# EAGLE design microSDport (EAGLE 8.4.0)
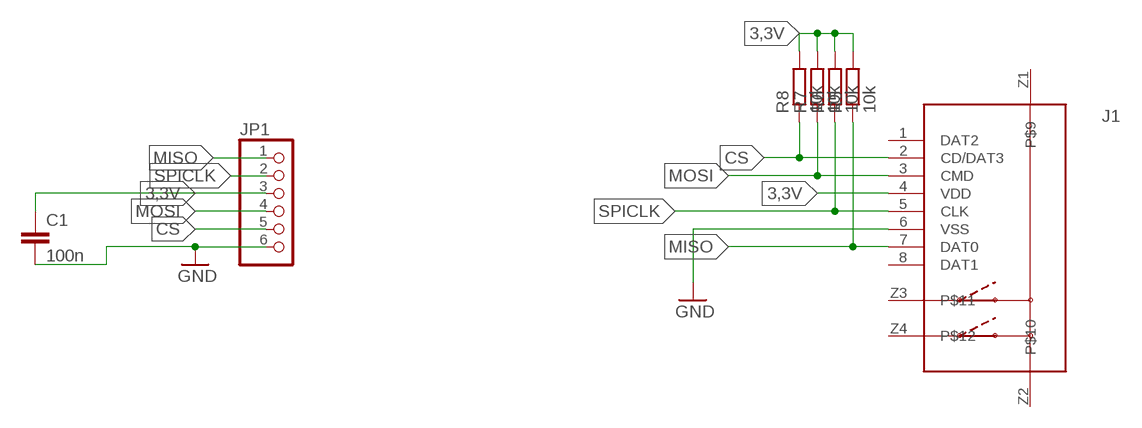
[diagram p0: schematic, sheet 1]

## Parts
C1  100n  C-EUC0805K  [C0805K]
J1  693072010801  [693072010801]
JP1  PINHD-1X6  [1X06]
R5  10k  R-EU_R0805  [R0805]
R6  10k  R-EU_R0805  [R0805]
R7  10k  R-EU_R0805  [R0805]
R8  10k  R-EU_R0805  [R0805]

## Nets
3,3V: C1.1 J1.4(VDD) JP1.3 R5.2 R6.2 R7.2 R8.2
CS: J1.2(CD/DAT3) JP1.5 R8.1
GND: C1.2 J1.6(VSS) JP1.6
MISO: J1.7(DAT0) JP1.1 R5.1
MOSI: J1.3(CMD) JP1.4 R7.1
SPICLK: J1.5(CLK) JP1.2 R6.1
Unconnected: J1.1(DAT2) J1.8(DAT1) J1.Z1 J1.Z2 J1.Z3 J1.Z4

## Library data of the parts
C1 = resistor:C-EU: CAPACITOR, European symbol
J1 = Wurth_Elektronik_Electromechanic_Input-Output_Connectors_rev16b:693072010801: WR-CRD MICRO SD CARD CONNECTOR HINGE 8PINS=>Code : Con_I-O_COM_CRD_SD_Micro_696072010801 <http://katalog.we-online.de/media/images/eican/Con_I-O_COM_CRD_SD_Micro_696072010801_pf2.jpg> Details see: http://katalog.we-online.de/en/em/693_072_010_801 Created 2014-07-09, Karrer Zheng 2014 (C) Würth Elektronik
JP1 = pinhead:PINHD-1X6: PIN HEADER
R5-R8 = resistor:R-EU_: RESISTOR, European symbol

## Board
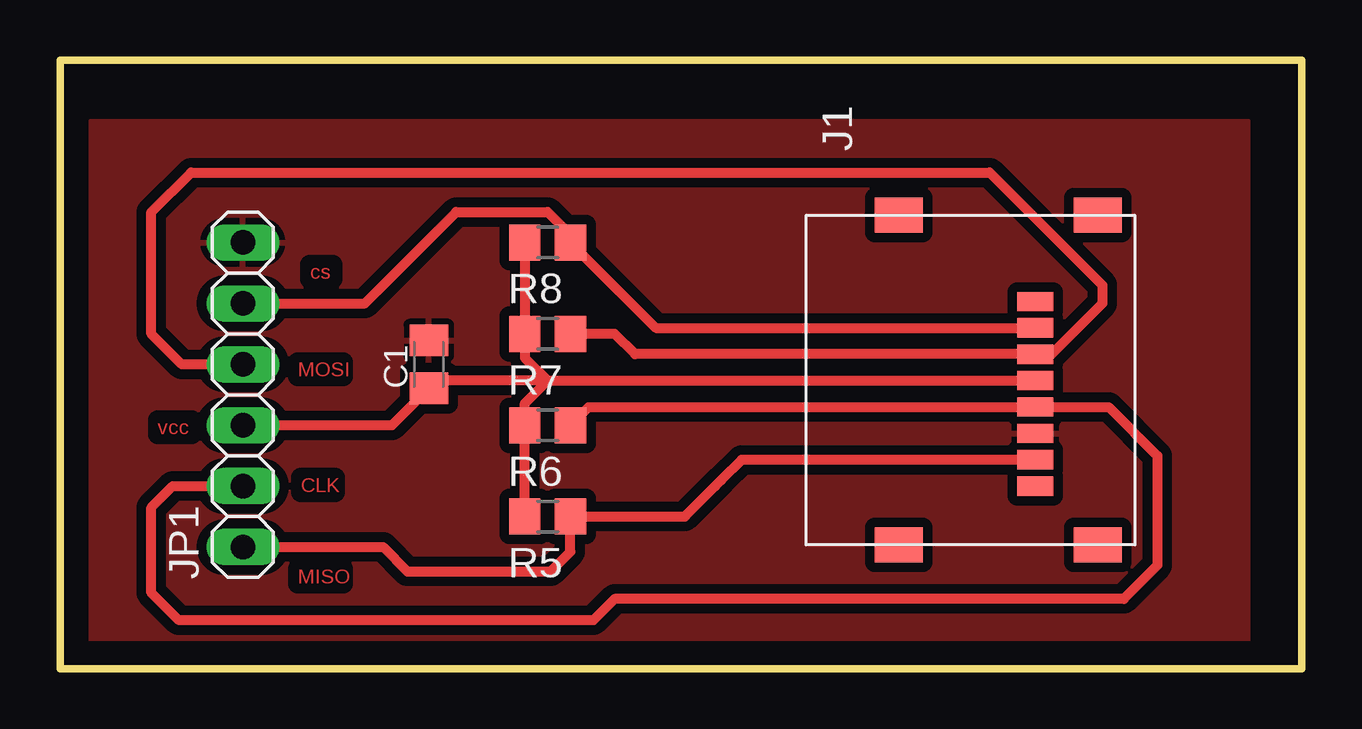
[diagram p1: board, top side]

Size 51.74 x 25.39 mm. Coordinates in mm from the lower left corner, seen from the top.
Outline: 0,0 51.74,0 51.74,25.39 0,25.39 0,0
Copper layers (1*16): Top 0.035mm / dielectric 1.5mm / Bottom 0.035mm
Design rules "default": minimum track width 6mil, minimum drill 0.35mm, track to track 6mil, track to pad 6mil, pad to pad 6mil, via to via 6mil, smd to smd 6mil, copper to edge 40mil, drill to drill 6mil, minimum pad ring 10mil, minimum via ring 8mil, stop-mask expansion 4mil, vias tented up to drill 0mil, thermal gap 10mil

### Footprints (pad centres in the part's own frame; a part is rotated, then mirrored left to right if it is on the bottom)
C0805K = smd 1.3 x 1.6: 1 -1,0; 2 1,0
693072010801 = smd 0.8 x 1.5: 1 7.7,0; 2 6.6,0; 3 5.5,0; 4 4.4,0; 5 3.3,0; 6 2.2,0; 7 1.1,0; 8 0,0 | smd 1.45 x 2: Z1 -2.45,5.7; Z2 11.3,5.7; Z3 -2.45,-2.6; Z4 11.3,-2.6
1X06 = drill 1.016 long: 1 -6.35,0; 2 -3.81,0; 3 -1.27,0; 4 1.27,0; 5 3.81,0; 6 6.35,0
R0805 = smd 1.3 x 1.5: 1 -0.95,0; 2 0.95,0

### Placement (x,y rotation side)
C1  15.37,12.7 90 top
J1  40.64,7.62 90 top
JP1  7.62,11.43 90 top
R5  20.32,6.35 180 top
R6  20.32,10.16 180 top
R7  20.32,13.97 180 top
R8  20.32,17.78 180 top

### Tracks (layer width: path | path; a pad name or v marks a point on that pad's centre or on a via)
3,3V
  Top 0.406: R5.2 R6.2 19.37,11.07 20.32,12.02 | R8.2 R7.2 | 19.37,13.4 R7.2 | JP1.3 13.83,10.16 C1.1 15.69,12.02 20.32,12.02 | 20.32,12.02 J1.4 | R7.2 19.37,12.97 20.32,12.02
CS
  Top 0.406: JP1.5 12.7,15.24 16.51,19.05 20.32,19.05 21.27,18.1 R8.1 24.83,14.22 J1.2
GND
  pour Top (isolate 0.406): 1.27,22.86 49.53,22.86 49.53,0 1.27,0
MISO
  Top 0.406: JP1.1 13.46,5.08 14.48,4.06 20.45,4.06 21.27,4.89 R5.1 26.04,6.35 27.3,7.62 27.56,7.87 28.41,8.72 J1.7
MOSI
  Top 0.406: R7.1 23.11,13.97 23.96,13.12 40.51,13.12 J1.3 41.31,13.12 43.43,15.24 43.43,16 38.73,20.7 5.46,20.7 3.81,19.05 3.81,13.97 5.08,12.7 JP1.4
SPICLK
  Top 0.406: R6.1 22.03,10.92 J1.5 43.69,10.92 45.72,8.89 45.72,4.32 44.32,2.92 23.11,2.92 22.23,2.03 4.95,2.03 3.81,3.17 3.81,6.73 4.7,7.62 JP1.2

### Text on the board
Top: cs | MOSI | vcc | CLK | MISO